# Altium project DB-X01.PrjPcb (part 5 of 5)
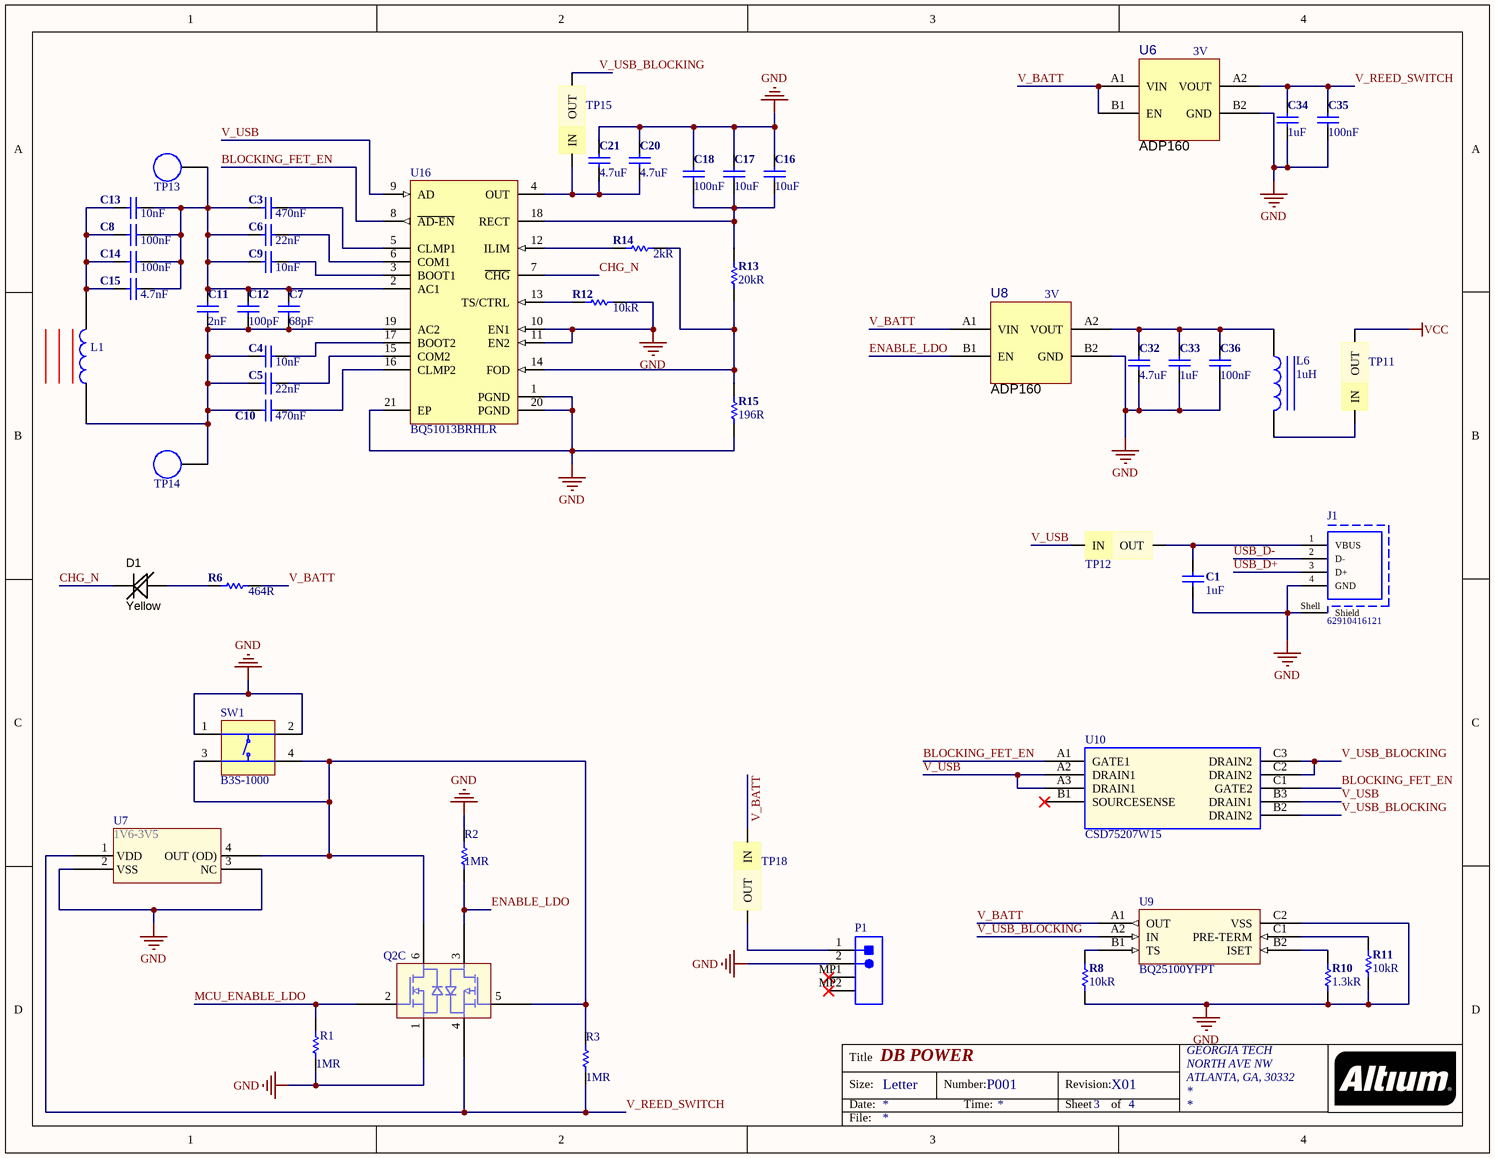
[diagram p5: DB_Power-X01.SchDoc]

## Sheet DB_Power-X01.SchDoc: DB POWER (continued)

### Library data of the parts (continued)
R14 = R-0402(1005): Fixed Resistor, Metal Glaze/thick Film, 0.0625W, 2000ohm, 50V, 1% +/-Tol, 100ppm/Cel, Surface Mount, 0402; Manufacturer: Yageo; Manufacturer Part Number: AC0402FR-072KL; Power Rating: 62.5mW; Max Power Dissipation: 63mW; Temperature Coefficient: 100ppm/°C; Supplier 1: Digi-Key; Supplier Part Number 1: YAG3470CT-ND; RoHS: Yes; Category: Chip SMD Resistors; Stock 1: 172746; Pricing 1: 1=0.10000, 10=0.02100, 100=0.00870, 1000=0.00390, 2500=0.00338, 5000=0.00279 (USD); Case/Package: 0402; Weight: 2.3E-05oz; Case Code (Imperial): 0402; Case Code (Metric): 1005; Min Operating Temperature: -55°C; Max Operating Temperature: 155°C; Tolerance: 1%; Packaging: Tape and Reel; Resistance: 2kR; Voltage Rating: 50V; Composition: Thick Film; Number of Terminations: 2; Termination: SMD/SMT; Features: Moisture Resistant,Automotive AEC-Q200; Length: 0.039inch; Height: 0.015inch; Width: 0.02inch; Lead Free: Lead Free; ComponentLink1URL: https://datasheet.ciiva.com:443/pdfs/VipMasterIC/IC/YAGO/YAGO-S-A0003597364/YAGO-S-A0003597364-1.pdf?src-supplier=IHS+Markit; ComponentLink1Description: https://datasheet.ciiva.com:443/pdfs/VipMasterIC/IC/YAGO/YAGO-S-A0003597364/YAGO-S-A0003597364-1.pdf?src-supplier=IHS+Markit; ComponentLink2URL: https://datasheet.ciiva.com/12576/pyu-ac-51-rohs-l-2-12576349.pdf?src-supplier=Mouser; ComponentLink2Description: https://datasheet.ciiva.com/12576/pyu-ac-51-rohs-l-2-12576349.pdf?src-supplier=Mouser
R15 = R-0402(1005): Fixed Resistor, Metal Glaze/thick Film, 0.063W, 196ohm, 50V, 1% +/-Tol, 100ppm/Cel, Surface Mount, 0402; Manufacturer: Vishay; Manufacturer Part Number: CRCW0402196RFKED; Temperature Coefficient: 100ppm/°C; Max Power Dissipation: 63mW; Supplier 1: Digi-Key; Supplier Part Number 1: 541-196LCT-ND; RoHS: Yes; Category: Chip SMD Resistors; Stock 1: 16905; Pricing 1: 1=0.10000, 10=0.03800, 100=0.01560, 1000=0.00702, 2500=0.00610, 5000=0.00504 (USD); Case/Package: 0402; Number of Pins: 2; Weight: 2.3E-05oz; Case Code (Imperial): 0402; Case Code (Metric): 1005; Contact Plating: Tin; Min Operating Temperature: -55°C; Max Operating Temperature: 155°C; Resistance: 196R; Tolerance: 1%; Packaging: Tape and Reel; Package Quantity: 10; Composition: Thick Film; Number of Terminations: 2; Voltage Rating (DC): 50V; Features: Automotive AEC-Q200; Power Rating: 63mW; Voltage Rating: 50V; Termination: SMD/SMT; Military Standard: Not; Length: 1mm; Height: 0.016inch; Width: 0.5mm; Depth: 0.5mm; Radiation Hardening: No; Lead Free: Lead Free; REACH SVHC: Unknown; ComponentLink1URL: https://datasheet.ciiva.com:443/pdfs/VipMasterIC/IC/VISH/VISH-S-A0007266705/VISH-S-A0007266705-1.pdf?src-supplier=IHS+Markit; ComponentLink1Description: https://datasheet.ciiva.com:443/pdfs/VipMasterIC/IC/VISH/VISH-S-A0007266705/VISH-S-A0007266705-1.pdf?src-supplier=IHS+Markit; ComponentLink2URL: https://datasheet.ciiva.com/3256/dcrcwe3-3256135.pdf?src-supplier=Avnet; ComponentLink2Description: https://datasheet.ciiva.com/3256/dcrcwe3-3256135.pdf?src-supplier=Avnet; ComponentLink3URL: https://datasheet.ciiva.com/5547/dcrcwe3-109170-5547735.pdf?src-supplier=Mouser; ComponentLink3Description: https://datasheet.ciiva.com/5547/dcrcwe3-109170-5547735.pdf?src-supplier=Mouser; ComponentLink4URL: https://datasheet.ciiva.com/2525/dcrcwe3-2525689.pdf?src-supplier=Digi-Key; ComponentLink4Description: https://datasheet.ciiva.com/2525/dcrcwe3-2525689.pdf?src-supplier=Digi-Key; ComponentLink5URL: https://datasheet.ciiva.com/2525/dcrcwe3-2525690.pdf?src-supplier=Digi-Key; ComponentLink5Description: https://datasheet.ciiva.com/2525/dcrcwe3-2525690.pdf?src-supplier=Digi-Key; ComponentLink6URL: https://datasheet.ciiva.com/2525/dcrcwe3-2525691.pdf?src-supplier=Digi-Key; ComponentLink6Description: https://datasheet.ciiva.com/2525/dcrcwe3-2525691.pdf?src-supplier=Digi-Key; ComponentLink7URL: https://datasheet.ciiva.com/22707/1697337-22707323.pdf?src-supplier=Element14; ComponentLink7Description: https://datasheet.ciiva.com/22707/1697337-22707323.pdf?src-supplier=Element14
SW1 = CMP-1677-00001-4: Sealed Tactile Switch, SPST-NO, 3 to 24 V, -25 to 70 degC, 4-Pin SMD, RoHS, Bulk; Manufacturer: Omron; Manufacturer Part Number: B3S-1000P; Mechanical Life: 500000Cycles; Switch Function: Off-Mom; Illumination Type: Non-Illuminated; Number of Poles: 1; Switch Travel: 0.25mm; Throw Configuration: SPST; Voltage Rating (DC): 24V; Operating Force: 1.57N; Max Current Rating: 50mA; Contact Resistance: 100mR; Actuator Type: Standard; Actuator Length: 0.8mm; Ratings: IP67,Waterproof,Dust Tight; Supplier 1: Digi-Key; Supplier Part Number 1: SW836CT-ND; RoHS: Yes; Category: Tactile Switches; Stock 1: 209545; Pricing 1: 1=0.80000, 10=0.77500, 25=0.74520, 100=0.64690, 250=0.59024, 500=0.54850 (USD); Mount: Surface Mount; Weight: 0.010582oz; Contact Material: Bronze; Contact Plating: Silver; Min Operating Temperature: -25°C; Max Operating Temperature: 70°C; Orientation: Straight; Termination: Gull Wing; Electrical Life: 500000Cycles; Packaging: Tape and Reel; Package Quantity: 1; Current Rating: 50mA; Max Voltage Rating (DC): 24V; Contact Current Rating: 50mA; Length: 6.6mm; Height: 3.65mm; Depth: 9mm; Width: 6mm; Radiation Hardening: No; REACH SVHC: No SVHC; Lead Free: Lead Free; ComponentLink1URL: https://datasheet.ciiva.com:443/pdfs/VipMasterIC/IC/OMRN/OMRN-S-A0001309939/OMRN-S-A0001309939-1.pdf?src-supplier=IHS+Markit; ComponentLink1Description: https://datasheet.ciiva.com:443/pdfs/VipMasterIC/IC/OMRN/OMRN-S-A0001309939/OMRN-S-A0001309939-1.pdf?src-supplier=IHS+Markit; ComponentLink2URL: https://datasheet.ciiva.com/2899/b3s-1110-2899873.pdf?src-supplier=Digi-Key; ComponentLink2Description: https://datasheet.ciiva.com/2899/b3s-1110-2899873.pdf?src-supplier=Digi-Key; ComponentLink3URL: https://datasheet.ciiva.com/2899/b3s-1110-2899874.pdf?src-supplier=Digi-Key; ComponentLink3Description: https://datasheet.ciiva.com/2899/b3s-1110-2899874.pdf?src-supplier=Digi-Key; ComponentLink4URL: https://datasheet.ciiva.com/2899/b3s-1110-2899875.pdf?src-supplier=Digi-Key; ComponentLink4Description: https://datasheet.ciiva.com/2899/b3s-1110-2899875.pdf?src-supplier=Digi-Key; ComponentLink5URL: https://datasheet.ciiva.com/15183/getdatasheetpartid-211358-15183771.pdf?src-supplier=Verical; ComponentLink5Description: https://datasheet.ciiva.com/15183/getdatasheetpartid-211358-15183771.pdf?src-supplier=Verical; ComponentLink6URL: https://datasheet.ciiva.com/27056/2086750-27056652.pdf?src-supplier=Jameco; ComponentLink6Description: https://datasheet.ciiva.com/27056/2086750-27056652.pdf?src-supplier=Jameco; ComponentLink7URL: https://datasheet.ciiva.com/16155/en-b3s-16155006.pdf?src-supplier=Onlinecomponents.com; ComponentLink7Description: https://datasheet.ciiva.com/16155/en-b3s-16155006.pdf?src-supplier=Onlinecomponents.com; ComponentLink8URL: https://datasheet.ciiva.com/30125/en-b3s-30125455.pdf?src-supplier=Onlinecomponents.com; ComponentLink8Description: https://datasheet.ciiva.com/30125/en-b3s-30125455.pdf?src-supplier=Onlinecomponents.com
TP11 TP12 TP15 TP18 = JUMPER: SHUNT LP W/HANDLE 2 POS 30AU; Manufacturer: TE Connectivity; Manufacturer Part Number: 8815452; Number of Contacts: 2; Contact Current Rating: 3A; Contact Resistance: 15mR; Gender: Female; Pitch: 2.54mm; Approvals: UL,CSA; Supplier 1: Digi-Key; Supplier Part Number 1: A26242-ND; RoHS: Yes; Category: Headers and Wire Housings; Stock 1: 2099; Pricing 1: 1=0.280000, 10=0.262000, 25=0.223600, 50=0.195600, 100=0.181700, 250=0.160760, 500=0.153760, 1000=0.125800, 2500=0.115320 (USD); Contact Plating: Gold; Housing Color: Black; Housing Material: Thermoplastic; Contact Material: Bronze; Color: Black; Min Operating Temperature: -65°C; Max Operating Temperature: 105°C; Number of Rows: 1; Package Quantity: 14000; Packaging: Bag; Orientation: Straight; Number of Positions: 2; Contact Gender: Female; Current Rating: 3A; Termination: Solder; Length: 5.08mm; Height: 10.9mm; Depth: 10.9mm; Width: 2.5mm; Radiation Hardening: No; Flammability Rating: UL94 V-0; REACH SVHC: No SVHC; ComponentLink1URL: https://datasheet.ciiva.com/1455/92946-1455888.pdf?src-supplier=Newark; ComponentLink1Description: https://datasheet.ciiva.com/1455/92946-1455888.pdf?src-supplier=Newark; ComponentLink2URL: https://datasheet.ciiva.com/19459/841467-19459897.pdf?src-supplier=Jameco; ComponentLink2Description: https://datasheet.ciiva.com/19459/841467-19459897.pdf?src-supplier=Jameco; ComponentLink3URL: https://datasheet.ciiva.com/15174/getdatasheetpartid-155768-15174939.pdf?src-supplier=Verical; ComponentLink3Description: https://datasheet.ciiva.com/15174/getdatasheetpartid-155768-15174939.pdf?src-supplier=Verical; ComponentLink4URL: https://datasheet.ciiva.com/11754/0900766b80da19e8-11754990.pdf?src-supplier=RSComponents; ComponentLink4Description: https://datasheet.ciiva.com/11754/0900766b80da19e8-11754990.pdf?src-supplier=RSComponents; ComponentLink5URL: https://datasheet.ciiva.com/30154/eng-cs-1307819-section-6-7and8-0808-30154293.pdf?src-supplier=Onlinecomponents.com; ComponentLink5Description: https://datasheet.ciiva.com/30154/eng-cs-1307819-section-6-7and8-0808-30154293.pdf?src-supplier=Onlinecomponents.com; ComponentLink6URL: https://datasheet.ciiva.com/767/eng-cd-881545-k3-767850.pdf?src-supplier=Digi-Key; ComponentLink6Description: https://datasheet.ciiva.com/767/eng-cd-881545-k3-767850.pdf?src-supplier=Digi-Key; ComponentLink7URL: https://datasheet.ciiva.com/3120/eng-cs-1307819-section-6-7and8-0808-3120202.pdf?src-supplier=Avnet; ComponentLink7Description: https://datasheet.ciiva.com/3120/eng-cs-1307819-section-6-7and8-0808-3120202.pdf?src-supplier=Avnet
TP13 TP14 = S1751-46R: PC TEST POINT TIN SMD; Manufacturer: Harwin Inc.; Supplier 1: Digi-Key; RoHS: RoHS Compliant; Stock 1: 275112; Pricing 1: 1=0.29, 10=0.272, 25=0.2324, 50=0.2032, 100=0.1888, 250=0.167, 500=0.15972, 1000=0.13068 (USD); Packaging: Cut Tape (CT); Type: PC Test Point; Terminal: 0.128" x 0.065" x 0.079" (3.25mm x 1.65mm x 2.00mm) Brass, Tin Plated; Mounting Type: Surface Mount; Material: Copper Alloy; Color: Natural; ComponentLink1URL: http://cdn.harwin.com/pdfs/S1751.pdf; ComponentLink1Description: http://cdn.harwin.com/pdfs/S1751.pdf; Supplier Part Number 1: 952-1478-1-ND; Manufacturer Part Number: S1751-46R; Category: Test and Measurement
U6 U8 = ADP160: Fixed Positive LDO Regulator, 3V, 0.1V Dropout, CMOS, PBGA4; Manufacturer: Analog Devices; Manufacturer Part Number: ADP172ACBZ-3.0-R7; Dropout Voltage: 50mV; Number of Outputs: 1; Min Input Voltage: 1.6V; Max Input Voltage: 3.6V; Max Output Current: 300mA; Min Current Limit: 400mA; Nominal Supply Current: 23uA; Quiescent Current: 60uA; Power Supply Rejection Ratio (PSRR): 73dB; Max Supply Current: 170uA; Min Output Voltage: 800mV; Supplier 1: Digi-Key; Supplier Part Number 1: ADP172ACBZ-3.0-R7CT-ND; RoHS: Yes; Category: Voltage Regulators - Linear; Stock 1: 2; Pricing 1: 1=1.09000 (USD); Mount: Surface Mount; Number of Pins: 4; Contact Plating: Copper,Tin,Silver; Min Operating Temperature: -40°C; Max Operating Temperature: 125°C; Package Quantity: 3000; Packaging: Tape and Reel; Output Current: 300mA; Number of Regulators: 1; Polarity: Positive; Operating Supply Current: 23uA; Max Output Voltage: 3V; Output Type: Fixed; Radiation Hardening: No; Lead Free: Contains Lead; ComponentLink1URL: https://datasheet.ciiva.com:443/pdfs/VipMasterIC/IC/ANDI/ANDI-S-A0002823031/ANDI-S-A0002823031-1.pdf?src-supplier=IHS+Markit; ComponentLink1Description: https://datasheet.ciiva.com:443/pdfs/VipMasterIC/IC/ANDI/ANDI-S-A0002823031/ANDI-S-A0002823031-1.pdf?src-supplier=IHS+Markit; ComponentLink2URL: https://datasheet.ciiva.com/2056/adp172-2056690.pdf?src-supplier=Digi-Key; ComponentLink2Description: https://datasheet.ciiva.com/2056/adp172-2056690.pdf?src-supplier=Digi-Key; ComponentLink3URL: https://datasheet.ciiva.com/2056/adp172-2056691.pdf?src-supplier=Digi-Key; ComponentLink3Description: https://datasheet.ciiva.com/2056/adp172-2056691.pdf?src-supplier=Digi-Key; ComponentLink4URL: https://datasheet.ciiva.com/2056/adp172-2056692.pdf?src-supplier=Digi-Key; ComponentLink4Description: https://datasheet.ciiva.com/2056/adp172-2056692.pdf?src-supplier=Digi-Key; ComponentLink5URL: https://datasheet.ciiva.com/3224/adp172-3224693.pdf?src-supplier=Avnet; ComponentLink5Description: https://datasheet.ciiva.com/3224/adp172-3224693.pdf?src-supplier=Avnet; ComponentLink6URL: https://datasheet.ciiva.com/17365/adp172-17365245.pdf?src-supplier=Avnet+Europe; ComponentLink6Description: https://datasheet.ciiva.com/17365/adp172-17365245.pdf?src-supplier=Avnet+Europe; ComponentLink7URL: https://datasheet.ciiva.com/48694/001251525-da-01-en-ic-reg-ldo-adp172acbz-3-0-r7-wlcsp-4-adi-48694412.pdf?src-supplier=Conrad; ComponentLink7Description: https://datasheet.ciiva.com/48694/001251525-da-01-en-ic-reg-ldo-adp172acbz-3-0-r7-wlcsp-4-adi-48694412.pdf?src-supplier=Conrad
U7 = S-5712ANSL2-I4T1U: MAGNETIC SWITCH UNIPOLAR SNT-4A; Manufacturer: ABLIC U.S.A.; Supplier 1: Digi-Key; Supplier Part Number 1: 1662-1617-1-ND; Manufacturer Part Number: S-5712ANSL2-I4T1U; RoHS: No; Stock 1: 23; Pricing 1: 1=1.07000, 5=1.01400, 10=0.88300 (USD); ComponentLink1URL: https://www.ablic.com/en/doc/datasheet/hall_ics/S5712A_B_C_E.pdf?src-supplier=Digi-Key; ComponentLink1Description: https://www.ablic.com/en/doc/datasheet/hall_ics/S5712A_B_C_E.pdf?src-supplier=Digi-Key
U9 = BQ25100YFPT: Power Supply Support Circuit; Manufacturer: Texas Instruments; Output Voltage: 4.35V; Operating Supply Current: 75nA; Fault Protection: Over Voltage,Over Temperature,Short Circuit; Max Charge Current: 250mA; Battery Pack Voltage: 4.2V; Number of Cells: 1; Max Supply Voltage: 6.45V; Min Supply Voltage: 3.5V; Supplier 1: Digi-Key; Supplier Part Number 1: 296-38373-1-ND; Manufacturer Part Number: BQ25100YFPT; RoHS: Yes; Category: Batteries and Accessories; Stock 1: 3049; Pricing 1: 1=2.24000, 10=2.01100, 25=1.89760, 100=1.51800 (USD); Mount: Surface Mount; Number of Pins: 6; Weight: 6E-05oz; Contact Plating: Copper,Tin,Silver; Min Operating Temperature: -40°C; Max Operating Temperature: 85°C; Package Quantity: 250; Packaging: Tape and Reel; Output Current: 250mA; Lead Free: Lead Free; REACH SVHC: No SVHC; ComponentLink1URL: https://www.ti.com:443/lit/ds/symlink/bq25100.pdf?src-supplier=IHS+Markit; ComponentLink1Description: https://www.ti.com:443/lit/ds/symlink/bq25100.pdf?src-supplier=IHS+Markit; ComponentLink2URL: https://datasheet.ciiva.com/46404/1854517-46404758.pdf?src-supplier=Element14; ComponentLink2Description: https://datasheet.ciiva.com/46404/1854517-46404758.pdf?src-supplier=Element14
U10 = CSD75207W15: Small Signal Field-Effect Transistor, P-Channel, Metal-oxide Semiconductor FET; Manufacturer: Texas Instruments; Gate to Source Voltage (Vgs): -6V; Rise Time: 8.6ns; Rds On Max: 162mR; Input Capacitance: 595pF; Drain to Source Resistance: 27mR; Continuous Drain Current (ID): 3.9A; Max Power Dissipation: 700mW; Turn-On Delay Time: 12.8ns; Turn-Off Delay Time: 32.1ns; Fall Time: 16ns; Supplier 1: Digi-Key; Supplier Part Number 1: 296-40008-1-ND; Manufacturer Part Number: CSD75207W15; RoHS: Yes; Category: MOSFETs; Stock 1: 8699; Pricing 1: 1=0.62000, 10=0.54500, 25=0.51160, 100=0.37130, 250=0.35804, 500=0.31020, 1000=0.26400 (USD); Mount: Surface Mount; Number of Pins: 9; Contact Plating: Copper,Tin,Silver; Min Operating Temperature: -55°C; Max Operating Temperature: 150°C; Packaging: Tape and Reel; Package Quantity: 3000; Lead Free: Lead Free; ComponentLink1URL: https://www.ti.com:443/lit/ds/symlink/csd75207w15.pdf?src-supplier=IHS+Markit; ComponentLink1Description: https://www.ti.com:443/lit/ds/symlink/csd75207w15.pdf?src-supplier=IHS+Markit; ComponentLink2URL: https://datasheet.ciiva.com/24012/slps418-267251-24012416.pdf?src-supplier=Mouser; ComponentLink2Description: https://datasheet.ciiva.com/24012/slps418-267251-24012416.pdf?src-supplier=Mouser; ComponentLink3URL: https://datasheet.ciiva.com/30021/csd75207w15-30021933.pdf?src-supplier=Avnet; ComponentLink3Description: https://datasheet.ciiva.com/30021/csd75207w15-30021933.pdf?src-supplier=Avnet
U16 = TI-BQ51013B-RHL20: WPC 1.1 Compatible Fully Integrated Wireless Power Receiver IC, 4 V Min Input, 20-pin VQFN (RHL), Green (RoHS & no Sb/Br); Manufacturer: Texas Instruments; Operating Supply Current: 8mA; Output Current: 1.5A; Output Voltage: 5V; Supplier 1: Digi-Key; Supplier Part Number 1: 296-38885-1-ND; Manufacturer Part Number: BQ51013BRHLR; RoHS: Yes; Category: Power Management ICs; Stock 1: 8882; Pricing 1: 1=3.33000, 10=2.97000, 25=2.67320, 100=2.43540, 250=2.19780, 500=1.97208, 1000=1.66320 (USD); Mount: Surface Mount; Case/Package: VQFN; Number of Pins: 20; Contact Plating: Gold; Min Operating Temperature: 0°C; Max Operating Temperature: 125°C; Packaging: Tape and Reel; Package Quantity: 3000; Logic Function: Receiver; Lead Free: Lead Free; ComponentLink1URL: https://www.ti.com:443/lit/ds/symlink/bq51013b.pdf?src-supplier=IHS+Markit; ComponentLink1Description: https://www.ti.com:443/lit/ds/symlink/bq51013b.pdf?src-supplier=IHS+Markit; ComponentLink2URL: https://datasheet.ciiva.com/6601/bq51013b-6601292.pdf?src-supplier=Digi-Key; ComponentLink2Description: https://datasheet.ciiva.com/6601/bq51013b-6601292.pdf?src-supplier=Digi-Key

## Nets that join several sheets
GND: DB_Main-X01 (23 pins), DB_Power-X01 (34 pins)
VCC: DB_Main-X01 (24 pins), DB_Power-X01 (TP11.2)
MCU_ENABLE_LDO: DB_Main-X01 (U1.10), DB_Power-X01 (Q2.2 R1.1)
V_BATT: DB_Main-X01 (TP4.1), DB_Power-X01 (6 pins)
V_USB: DB_Main-X01 (TP5.1), DB_Power-X01 (5 pins)

## Assembly variants
Temperature_IMU: all parts fitted